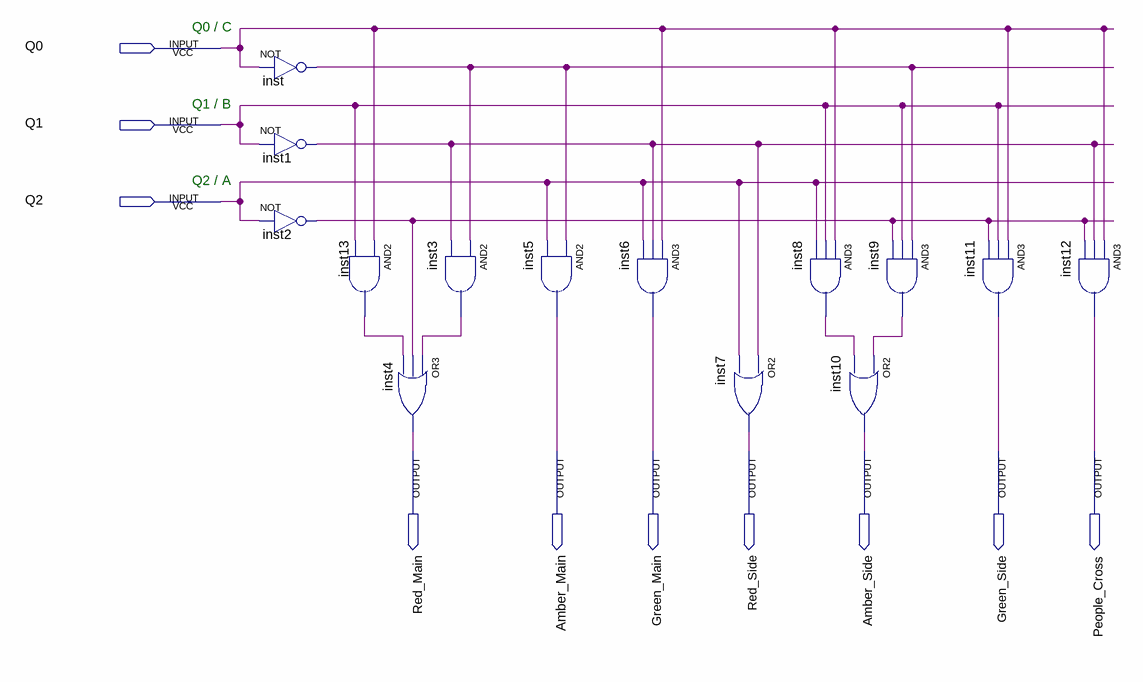
[diagram p0: schematic sheet]
// Quartus schematic Light_Decoder.bdf as structural Verilog: 14 symbols, 10 pins
module Light_Decoder (
  input  Q0,
  input  Q1,
  input  Q2,
  output Red_Main,
  output Amber_Main,
  output Green_Main,
  output Red_Side,
  output Amber_Side,
  output Green_Side,
  output People_Cross
);

  wire inst1_out, inst2_out, inst3_out, inst8_out, inst9_out, inst13_out, inst_out;

  not inst (inst_out, Q0);
  not inst1 (inst1_out, Q1);
  not inst2 (inst2_out, Q2);
  and inst13 (inst13_out, Q0, Q1);
  and inst3 (inst3_out, inst_out, inst1_out);
  or inst4 (Red_Main, inst3_out, inst2_out, inst13_out);
  and inst5 (Amber_Main, inst_out, Q2);
  and inst6 (Green_Main, Q0, inst1_out, Q2);
  or inst7 (Red_Side, inst1_out, Q2);
  and inst8 (inst8_out, Q0, Q1, Q2);
  and inst9 (inst9_out, inst_out, Q1, inst2_out);
  or inst10 (Amber_Side, inst9_out, inst8_out);
  and inst11 (Green_Side, Q0, Q1, inst2_out);
  and inst12 (People_Cross, Q0, inst1_out, inst2_out);

  // Notes on the sheet:
  //   Q0 / C
  //   Q1 / B
  //   Q2 / A
endmodule
